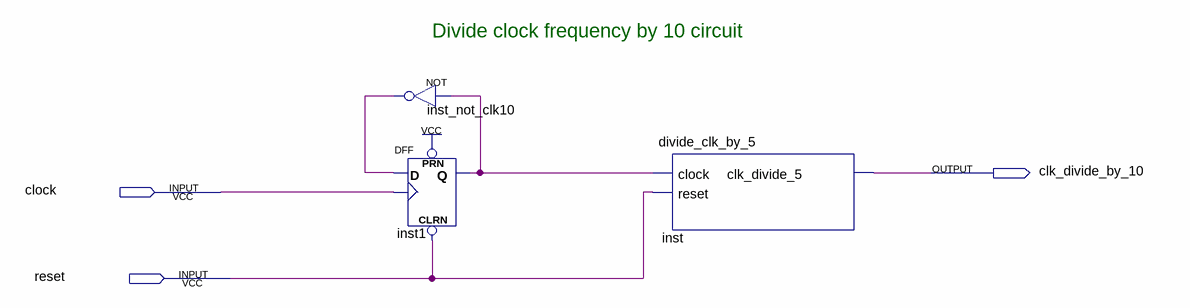
[diagram p0: schematic sheet]
// Quartus schematic divide_clk_by_10.bdf as structural Verilog: 3 symbols, 3 pins
module divide_clk_by_10 (
  input  clock,
  input  reset,
  output clk_divide_by_10
);

  wire inst1_q, inst_not_clk10_out;

  not inst_not_clk10 (inst_not_clk10_out, inst1_q);
  DFF inst1 (.CLRN(reset), .CLK(clock), .D(inst_not_clk10_out), .PRN(1'b1), .Q(inst1_q));
  divide_clk_by_5 inst (.clock(inst1_q), .reset(reset), .clk_divide_5(clk_divide_by_10));

  // Notes on the sheet:
  //   Divide clock frequency by 10 circuit      
endmodule
